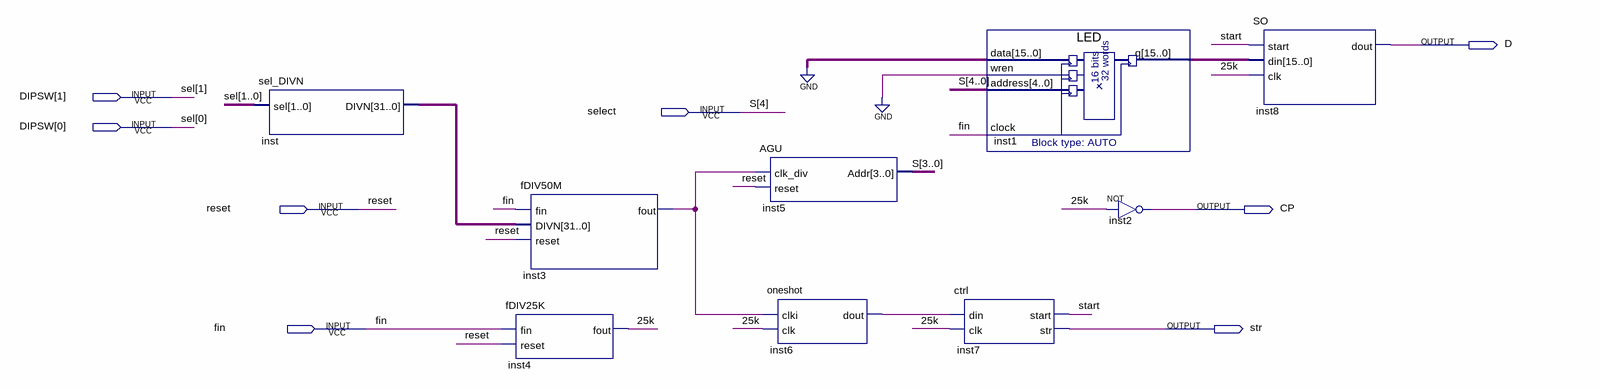
[diagram p0: schematic sheet]
// Quartus schematic hw4.bdf as structural Verilog: 9 symbols, 8 pins
module hw4 (
  input  [1:0] DIPSW,
  input  select,
  input  reset,
  input  fin,
  output D,
  output CP,
  output str
);

  wire \25k , inst3_fout, inst6_dout, start;
  wire [3:0] S;
  wire [15:0] inst1_q;
  wire [31:0] inst_divn;

  sel_DIVN inst (.sel(DIPSW), .DIVN(inst_divn));
  fDIV25K inst4 (.fin(fin), .reset(reset), .fout(\25k ));
  fDIV50M inst3 (.fin(fin), .DIVN(inst_divn), .reset(reset), .fout(inst3_fout));
  AGU inst5 (.clk_div(inst3_fout), .reset(reset), .Addr(S));
  oneshot inst6 (.clki(inst3_fout), .clk(\25k ), .dout(inst6_dout));
  ctrl inst7 (.din(inst6_dout), .clk(\25k ), .start(start), .str(str));
  LED inst1 (.data({16{1'b0}}), .wren(1'b0), .address({select, S}), .clock(fin), .q(inst1_q));
  not inst2 (CP, \25k );
  SO inst8 (.start(start), .din(inst1_q), .clk(\25k ), .dout(D));

  // Other names for the same wires on the sheet: S[4] = select; sel[1:0] = DIPSW
endmodule
